# Altium schematic sheet Sheet1.SchDoc
size A4; CompanyName: SpaceBee Technologies; Organization: Open Space; Address1: Argentina; DocumentNumber: 1; Revision: 0; SheetNumber: 1; SheetTotal: 1; Proyect: Rovertito; Mail: mgmt@spacebeetech.com
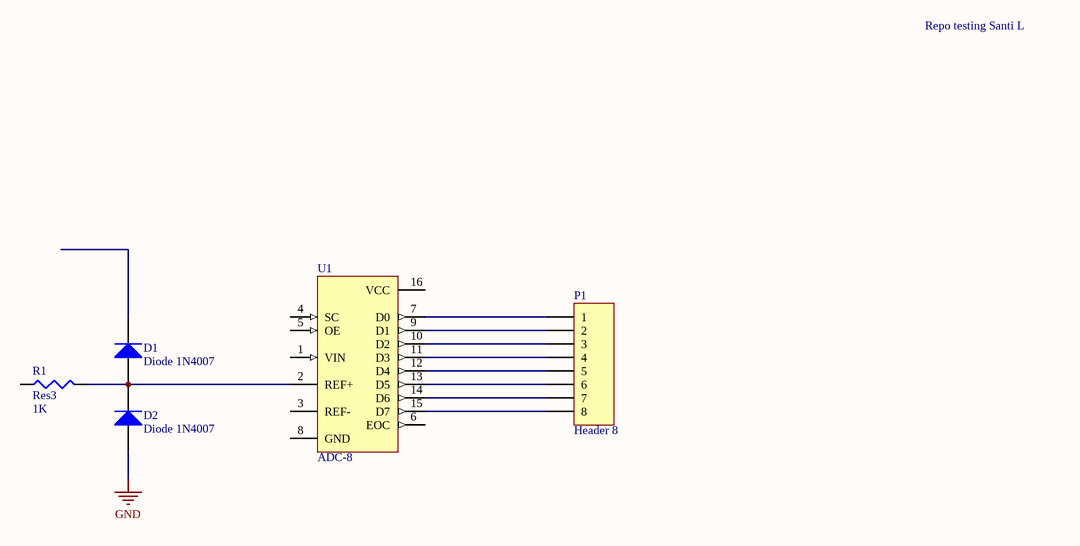
[diagram p0: Sheet1.SchDoc]

## Parts
D1  Diode 1N4007  [DO-41]
D2  Diode 1N4007  [DO-41]
P1  Header 8  [HDR1X8]
R1  Res3  value 1K  [J1-0603]
U1  ADC-8  [SOT403-1_N]

## Nets
GND: D2.1(A)
NetD1_1: D1.1(A) D2.2(K) R1.2 U1.2(REF+)
NetP1_1: P1.1 U1.7(D0)
NetP1_2: P1.2 U1.9(D1)
NetP1_3: P1.3 U1.10(D2)
NetP1_4: P1.4 U1.11(D3)
NetP1_5: P1.5 U1.12(D4)
NetP1_6: P1.6 U1.13(D5)
NetP1_7: P1.7 U1.14(D6)
NetP1_8: P1.8 U1.15(D7)

Not connected (* = marked no-connect by the designer): D1 2(K); R1 1; U1 1(VIN) 3(REF-) 4(SC) 5(OE) 6(EOC) 8(GND) 16(VCC)

## Notes on the sheet
- Repo testing Santi L
- Title
- Board:
- File:
- Authors
- M. Armanasco
- S. Nuñez
- M. Vagalao
- Proyect:
- Date:
- Mail:
- Size:
- Sheet
- A4
- of
- Organization:
- Revision:
- S. Rodriguez
- S. Leguizamon
- J. Alvarez
- and

## Library data of the parts
D1 D2 = Diode 1N4007: 1 Amp General Purpose Rectifier; Published: 8-Jun-2000; LatestRevisionDate: 17-Jul-2002; LatestRevisionNote: Re-released for DXP Platform.; DatasheetVersion: 1998; PackageVersion: Aug-1999; PackageReference: DO-41; Publisher: Altium Limited; PackageDescription: Diode, Axial; Body 5.2 x 2.7 mm (LxDia. max), Lead Dia. 0.86 mm (max); Code_JEDEC: DO-204-AL; ComponentLink1Description: Manufacturer Link; ComponentLink1URL: http://www.fairchildsemi.com/; ComponentLink2Description: Datasheet; ComponentLink2URL: http://www.fairchildsemi.com/ds/1N%2F1N4001.pdf
P1 = Header 8: Header, 8-Pin; LatestRevisionDate: 17-Jul-2002; LatestRevisionNote: Re-released for DXP Platform.; Publisher: Altium Limited
R1 = Res3: Resistor; Published: 8-Jun-2000; LatestRevisionDate: 29-May-2009; LatestRevisionNote: IPC-7351 Footprint Added.; PackageReference: J1-0603; Publisher: Altium Limited; PackageDescription: Chip Resistor
U1 = ADC-8: Generic 8-Bit A/D Converter; Published: 8-Jun-2000; LatestRevisionDate: 29-May-2009; LatestRevisionNote: IPC-7351 Footprint Added.; PackageVersion: Mar-2002; PackageReference: SOT403-1; Publisher: Altium Limited; PackageDescription: 16-Pin Thin Small Outline Package 0.65 mm Pitch; Code_JEDEC: MO-153